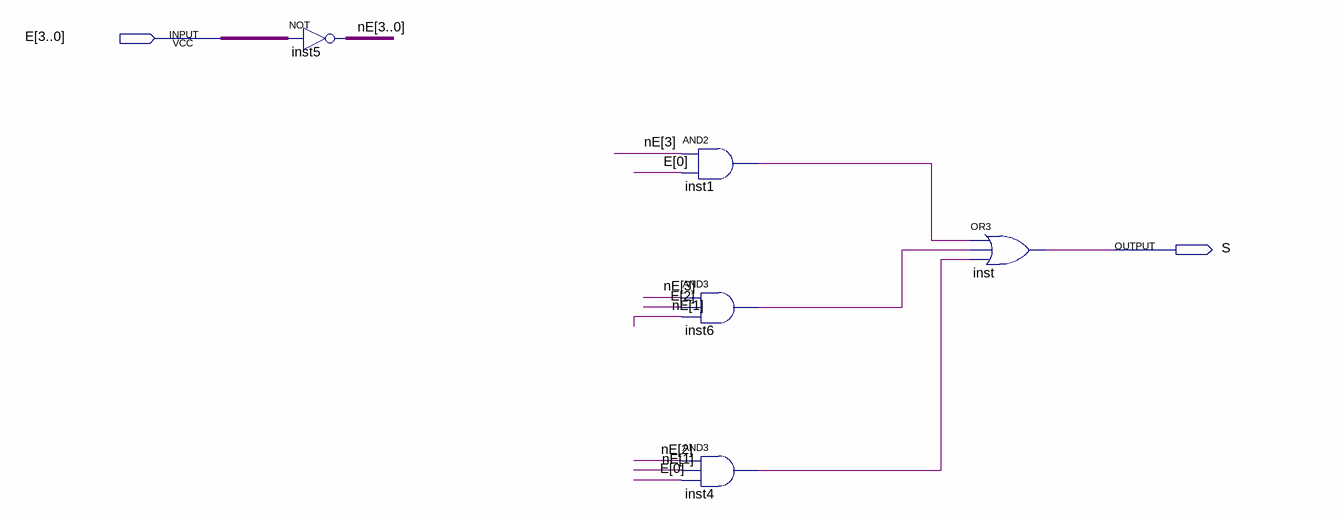
[diagram p0: schematic sheet]
// Quartus schematic ledE.bdf as structural Verilog: 5 symbols, 2 pins
module ledE (
  input  [3:0] E,
  output S
);

  wire inst1_out, inst4_out, inst6_out;
  wire [3:0] nE;

  assign nE = ~E;  // NOT inst5, 4 bits wide
  and inst1 (inst1_out, nE[3], E[0]);
  and inst6 (inst6_out, nE[3], E[2], nE[1]);
  and inst4 (inst4_out, nE[2], nE[1], E[0]);
  or inst (S, inst1_out, inst6_out, inst4_out);
endmodule
